# EAGLE schematic ESP32Cam-Programmer-Public (EAGLE 9.6.1)
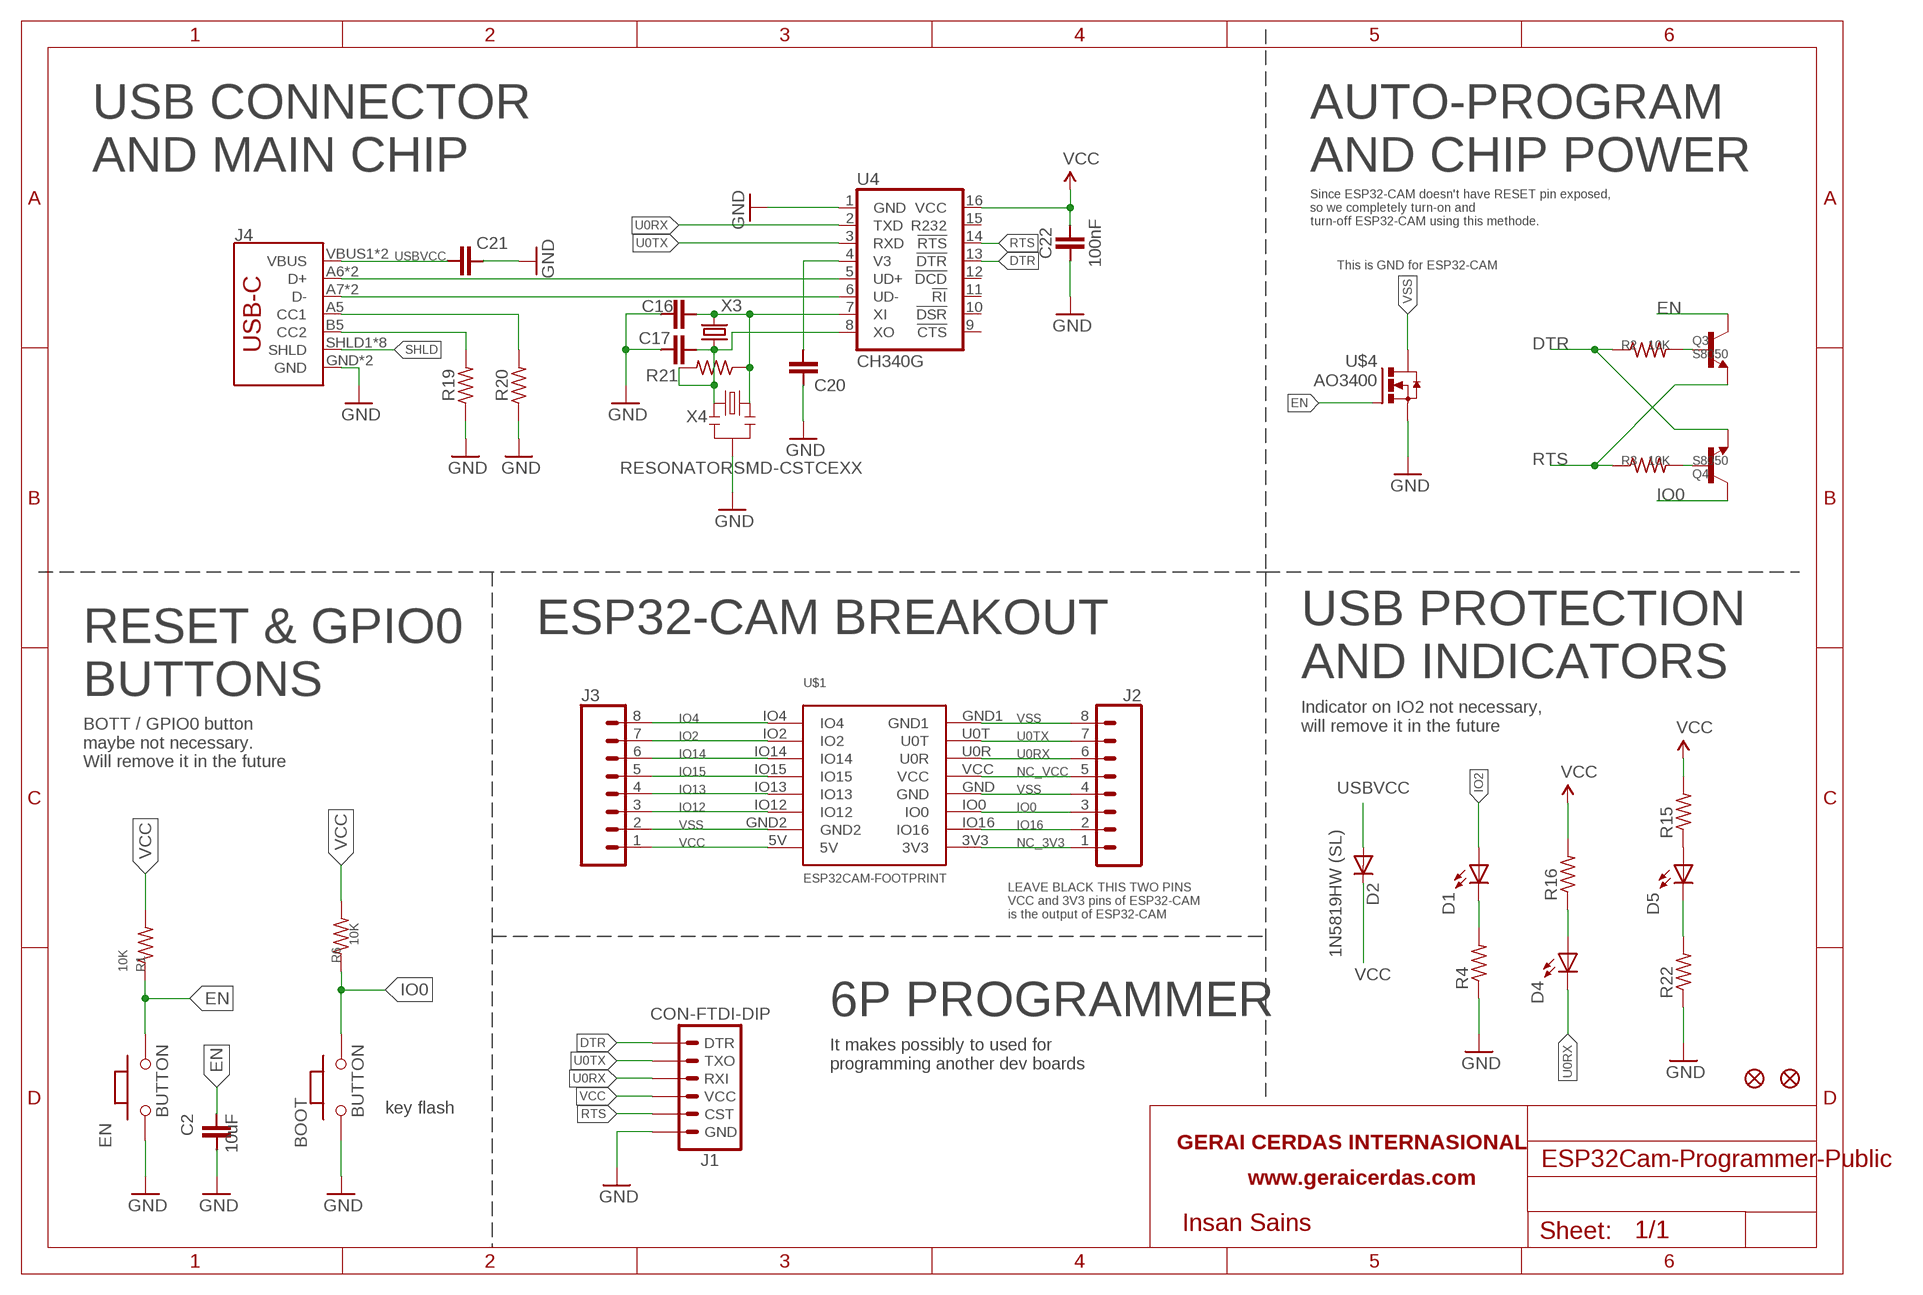
[diagram p0: schematic, sheet 1]

## Parts
BOOT  BUTTON  PB157  [157SW]
C2  10uF  CAPACITOR-SMD0603  [C0603]
C16  10pF  CAPACITOR-SMD0603  [C0603]
C17  10pF  CAPACITOR-SMD0603  [C0603]
C20  10nF  CAPACITOR-SMD0603  [C0603]
C21  100nF  CAPACITOR-SMD0603  [C0603]
C22  100nF  CAPACITOR-SMD0603  [C0603]
D1  Yellow  LED-SMD0805  [LED0805]
D2  1N5819HW (SL)  DIODE-1N4148-323  [SOD-323]
D4  GREEN  LED-SMD0805  [LED0805]
D5  Yellow  LED-SMD0805  [LED0805]
EN  BUTTON  PB157  [157SW]
J1  CON-FTDI-DIP  [CON-FTDI]
J2  CONN_08"  [1X08]
J3  CONN_08"  [1X08]
J4  USB_C16PIN  [USB-C-16P]
JP8  FIDUCIAL1X2  [FIDUCIAL-1X2]
JP9  FIDUCIAL1X2  [FIDUCIAL-1X2]
Q3  S8050  TRANSISTOR-NPN-S8050  [SOT-23]
Q4  S8050  TRANSISTOR-NPN-S8050  [SOT-23]
R1  10K  RESISTOR-SMD0603  [R0603]
R2  10K  RESISTOR-SMD0603  [R0603]
R3  10K  RESISTOR-SMD0603  [R0603]
R4  1K  RESISTOR-SMD0603  [R0603]
R6  10K  RESISTOR-SMD0603  [R0603]
R15  330  RESISTOR-SMD0603  [R0603]
R16  330  RESISTOR-SMD0603  [R0603]
R19  5.1k  RESISTOR-SMD0603  [R0603]
R20  5.1k  RESISTOR-SMD0603  [R0603]
R21  RESISTOR-SMD0603  [R0603]
R22  1K  RESISTOR-SMD0603  [R0603]
U4  CH340G  CH340GSMD  [SO016]
U$1  ESP32CAM-FOOTPRINT  [ESP32CAM]
U$4  AO3400  [SOT-23]
U$13  FRAME  [A4-HOR]
X3  XTAL-SMD  [SMD-CRYSTAL]
X4  RESONATORSMD-CSTCEXX  [CSTCE*]

## Nets
CC3: J4.A5(CC1) R20.2
CC4: J4.B5(CC2) R19.2
D+2: J4.A6(D+) J4.B6(D+) U4.5(UD+)
D-2: J4.A7(D-) J4.B7(D-) U4.6(UD-)
DTR: J1.DTR Q4.2(E) R2.1 U4.13(!DTR)
EN: C2.2 EN.2 Q3.3(C) R1.1 U$4.1(G)
GND: BOOT.1 C2.1 C16.1 C17.1 C20.2 C21.2 C22.1 EN.1 J1.GND J4.GND J4.GND2(GND) R4.1 R19.1 R20.1 R22.1 U4.1(GND) U$4.2(S) X4.2
IO0: BOOT.2 J2.3 Q4.3(C) R6.1 U$1.IO0
IO2: D1.A J3.7 U$1.IO2
IO4: J3.8 U$1.IO4
IO12: J3.3 U$1.IO12
IO13: J3.4 U$1.IO13
IO14: J3.6 U$1.IO14
IO15: J3.5 U$1.IO15
IO16: J2.2 U$1.IO16
N$2: D1.C R4.2
N$9: Q3.1(B) R2.2
N$10: Q4.1(B) R3.2
N$14: D4.A R16.1
N$15: D5.A R15.1
N$16: C17.2 R21.2 U4.8(XO) X3.1 X4.1
N$17: C16.2 R21.1 U4.7(XI) X3.2 X4.3
N$18: D5.C R22.2
NC_3V3: J2.1 U$1.3V3
NC_VCC: J2.5 U$1.VCC
RTS: J1.CTS(CST) Q3.2(E) R3.1 U4.14(!RTS)
SHLD: J4.SHLD1(SHLD) J4.SHLD2(SHLD) J4.SHLD3(SHLD) J4.SHLD4(SHLD) J4.SHLD5(SHLD) J4.SHLD6(SHLD) J4.SHLD7(SHLD) J4.SHLD8(SHLD)
U0RX: D4.C J1.RXI J2.6 U4.2(TXD) U$1.U0R
U0TX: J1.TX0(TXO) J2.7 U4.3(RXD) U$1.U0T
USBVCC: C21.1 D2.A J4.VBUS1(VBUS) J4.VBUS2(VBUS)
V1: C20.1 U4.4(V3)
VCC: C22.2 D2.C J1.VCC J3.1 R1.2 R6.2 R15.2 R16.2 U4.16(VCC) U$1.5V
VSS: J2.4 J2.8 J3.2 U$1.GND U$1.GND1 U$1.GND2 U$4.3(D)
Unconnected: U4.9(!CTS) U4.10(!DSR) U4.11(!RI) U4.12(!DCD) U4.15(R232)

## Notes on the sheet
- USB CONNECTOR
  AND MAIN CHIP
- AUTO-PROGRAM
  AND CHIP POWER
- Since ESP32-CAM doesn't have RESET pin exposed,
  so we completely turn-on and 
  turn-off ESP32-CAM using this methode.
- This is GND for ESP32-CAM
- ESP32-CAM BREAKOUT
- USB PROTECTION
  AND INDICATORS
- RESET & GPIO0
  BUTTONS
- Indicator on IO2 not necessary,
  will remove it in the future
- BOTT / GPIO0 button 
  maybe not necessary.
  Will remove it in the future
- LEAVE BLACK THIS TWO PINS
  VCC and 3V3 pins of ESP32-CAM
  is the output of ESP32-CAM
- 6P PROGRAMMER
- It makes possibly to used for
  programming another dev boards
- key flash
- Insan Sains

## Library data of the parts
BOOT EN = MySMD:PB157
C2 C16 C17 C20-C22 = geraicerdas:CAPACITOR
D1 D4 D5 = geraicerdas:LED
D2 = geraicerdas:DIODE: DIODE, SWITCHING, 75V, SOD-523F-2 Source : View Datasheet <https://datasheet.lcsc.com/szlcsc/1810242227_ON-Semiconductor-1N4148WT_C232841.pdf>; DATASHEET: https://datasheet.lcsc.com/szlcsc/1810232207_ON-Semiconductor-1N4148WS_C118873.pdf; MANUFACTURER_PART_NUMBER: 1N4148WS
J1 = geraicerdas:CON-FTDI
J2 J3 = SparkFun-Connectors:CONN_08: Multi connection point. Often used as Generic Header-pin footprint for 0.1 inch spaced/style header connections On any of the 0.1 inch spaced packages, you can populate with these: Break Away Headers - Straight <https://www.sparkfun.com/products/116> (PRT-00116) Break Away Male Headers - Right Angle <https://www.sparkfun.com/products/553> (PRT-00553) Female Headers <https://www.sparkfun.com/products/115> (PRT-00115) Break Away Headers - Machine Pin <https://www.sparkfun.com/products/117> (PRT-00117) Break Away Female Headers - Swiss Machine Pin <https://www.sparkfun.com/products/743> (PRT-00743) Arduino Stackable Header - 8 Pin <https://www.sparkfun.com/products/9279> (PRT-09279) For SCREWTERMINALS and SPRING TERMINALS visit here: Screw Terimnals on SparkFun.com <https://www.sparkfun.com/search/results?term=Screw+Terminals> (5mm/3.5mm/2.54mm spacing) This device is also useful as a general connection point to wire up your design to another part of your project. Our various solder wires solder well into these plated through hole pads. Hook-Up Wire - Assortment (Stranded, 22 AWG) <https://www.sparkfun.com/products/11375> (PRT-11375) Hook-Up Wire - Assortment (Solid Core, 22 AWG) <https://www.sparkfun.com/products/11367> (PRT-11367) View the entire wire category on our website here <https://www.sparkfun.com/categories/141> Special notes: Molex polarized connector foot print use with SKU : PRT-08231 with associated crimp pins and housings. 1MM SMD Version SKU: PRT-10208 NOTES ON THE VARIANTS LOCK and LOCK_LONGPADS... This footprint was designed to help hold the alignment of a through-hole component (i.e. 6-pin header) while soldering it into place. You may notice that each hole has been shifted either up or down by 0.005 of an inch from it's more standard position (which is a perfectly straight line). This slight alteration caused the pins (the squares in the middle) to touch the edges of the holes. Because they are alternating, it causes a "brace" to hold the component in place. 0.005 has proven to be the perfect amount of "off-center" position when using our standard breakaway headers. Although looks a little odd when you look at the bare footprint, once you have a header in there, the alteration is very hard to notice. Also,if you push a header all the way into place, it is covered up entirely on the bottom side.; PROD_ID: CONN-08438
J4 = SparkFun-Connectors:USB_C: USB Type C 16Pin Connector Super Speed pins not available on the 16-pin purely SMD connector so this part is best for USB 2.0 implementations. D1 and D2 are tied together enabling D+/- no matter which way the cable is plugged into the connector. The two channel configuration pins (CC1/2) are exposed. These are normally connected to ground via 5.1k resistors but can be reconfigured for high current/high power applications.; PROD_ID: CONN-14122
JP8 JP9 = SparkFun:FIDUCIAL: Fiducial Alignment Points Various fiducial points for machine vision alignment.
Q3 Q4 = geraicerdas:TRANSISTOR-NPN: Transistor GP BJT NPN 40V 0.2A SOT23 Fairchild MMBT3904 NPN Bipolar Transistor, 0.2 A, 40 V, 3-Pin SOT-23 Source : View Datasheet <https://datasheet.lcsc.com/szlcsc/ON-Semicon-ON-MMBT3904LT1G_C81464.pdf>; DATASHEET: https://datasheet.lcsc.com/szlcsc/1809211225_Guangdong-Hottech-S8050_C181158.pdf; LCSC: C181158; MPN: S8050
R1-R4 R6 R15 R16 R19-R22 = geraicerdas:RESISTOR
U4 = SparkFun-DigitalIC:CH340G: A simple USB 2.0 to Serial IC.; PROD_ID: IC-13498
U$1 = geraicerdas:ESP32CAM
U$4 = geraicerdas:AO3400
U$13 = geraicerdas:FRAME
X3 = geraicerdas:XTAL
X4 = geraicerdas:RESONATOR